# EAGLE design probatio-rotary-8leds-5050 (EAGLE 9.6.2)
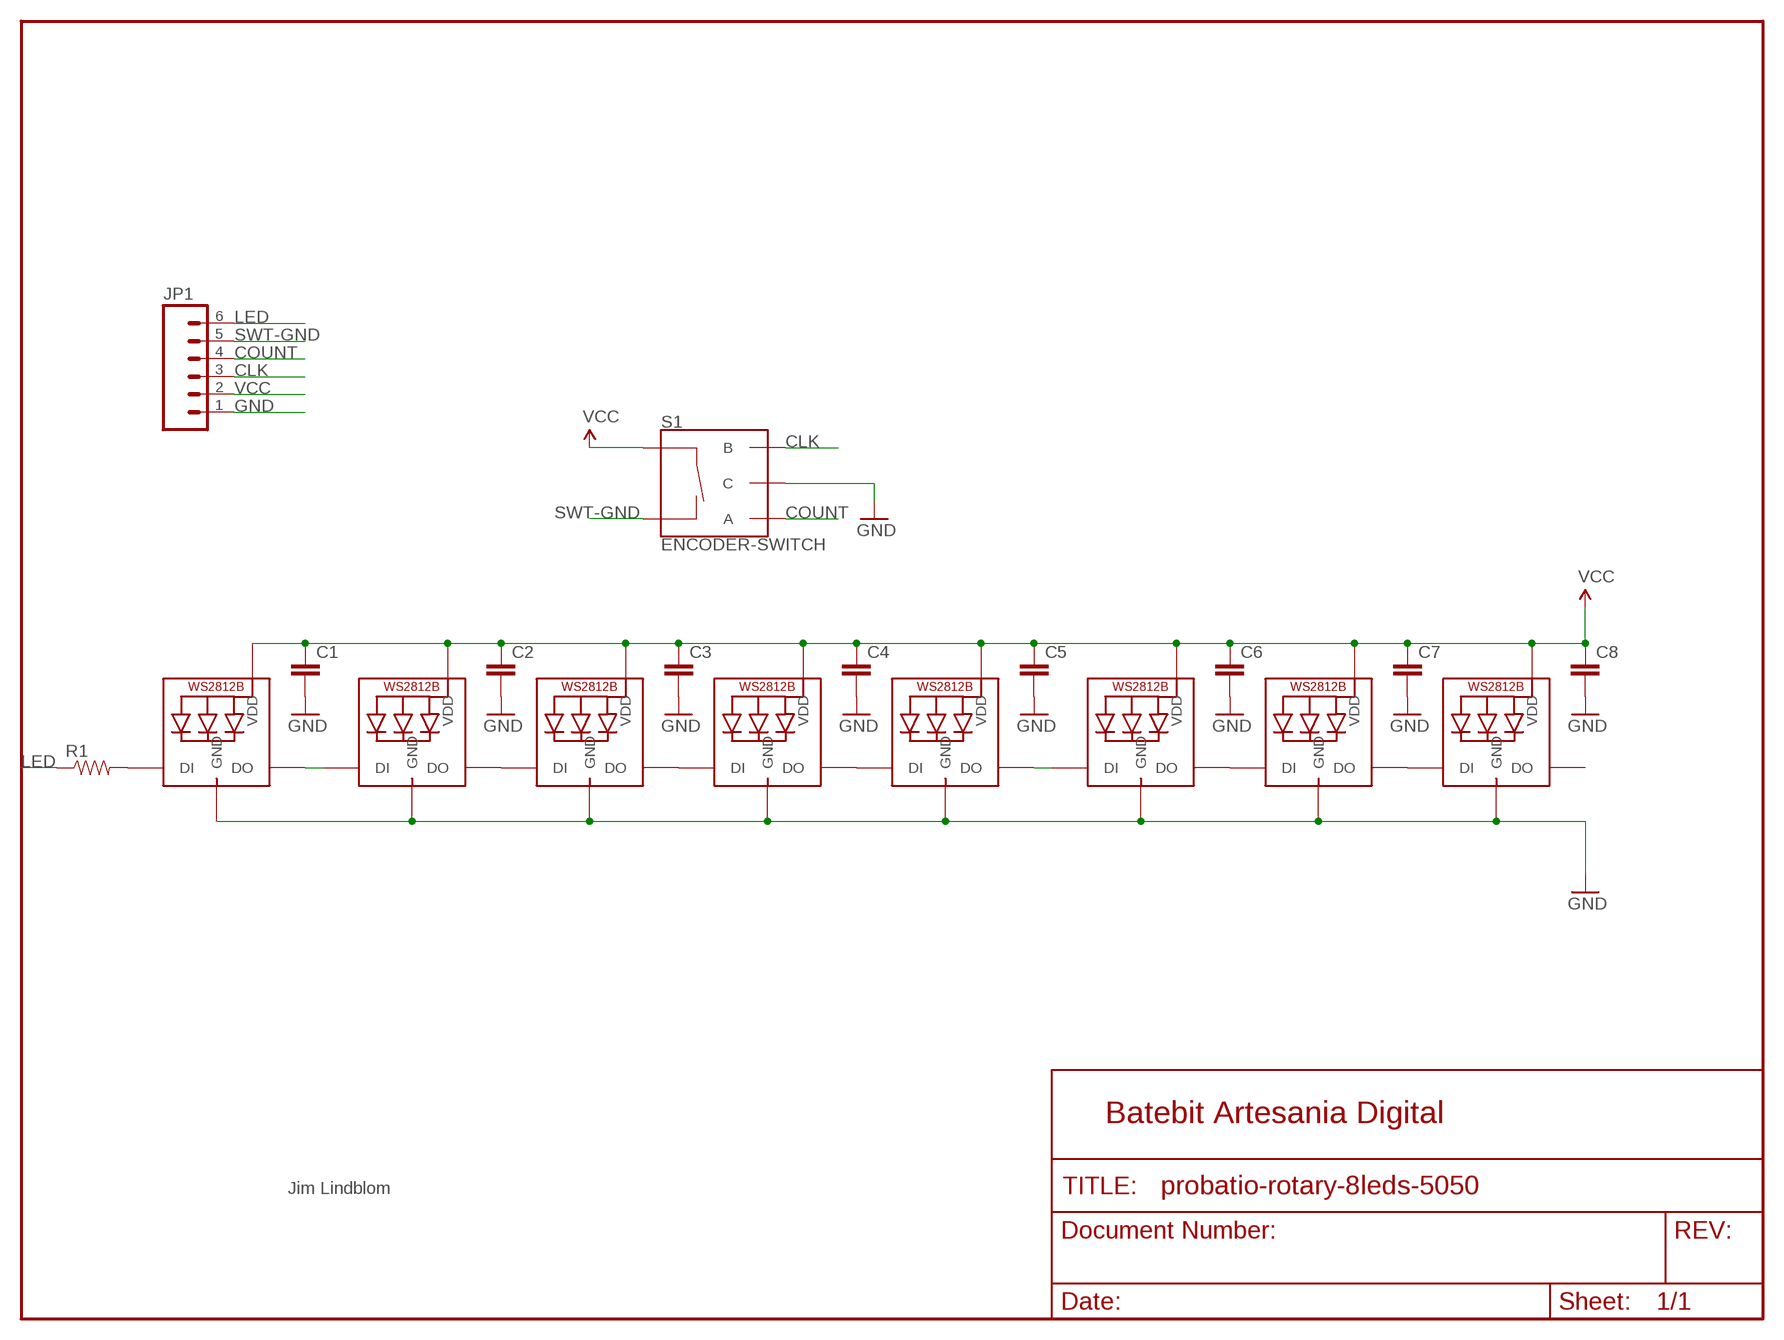
[diagram p0: schematic, sheet 1]

## Parts
C1  CAP0805-CAP  [0805-CAP]
C2  CAP0805-CAP  [0805-CAP]
C3  CAP0805-CAP  [0805-CAP]
C4  CAP0805-CAP  [0805-CAP]
C5  CAP0805-CAP  [0805-CAP]
C6  CAP0805-CAP  [0805-CAP]
C7  CAP0805-CAP  [0805-CAP]
C8  CAP0805-CAP  [0805-CAP]
JP1  M06SILK_FEMALE_PTH  [1X06]
LED1  WS2812B5050  [WS2812B]
LED2  WS2812B5050  [WS2812B]
LED3  WS2812B5050  [WS2812B]
LED4  WS2812B5050  [WS2812B]
LED5  WS2812B5050  [WS2812B]
LED6  WS2812B5050  [WS2812B]
LED7  WS2812B5050  [WS2812B]
LED8  WS2812B5050  [WS2812B]
R1  RESISTOR0805-RES  [0805-RES]
S1  ENCODER-SWITCH  [ROTARY_ENC_PLAIN]

## Nets
CLK: JP1.3 S1.B
COUNT: JP1.4 S1.A
GND [Power]: C1.2 C2.2 C3.2 C4.2 C5.2 C6.2 C7.2 C8.2 JP1.1 LED1.3-GND(GND) LED2.3-GND(GND) LED3.3-GND(GND) LED4.3-GND(GND) LED5.3-GND(GND) LED6.3-GND(GND) LED7.3-GND(GND) LED8.3-GND(GND) S1.C
LED: JP1.6 R1.1
N$1: LED1.2-DOUT(DO) LED2.4-DIN(DI)
N$2: LED1.4-DIN(DI) R1.2
N$3: LED2.2-DOUT(DO) LED3.4-DIN(DI)
N$4: LED5.2-DOUT(DO) LED6.4-DIN(DI)
N$5: LED3.2-DOUT(DO) LED4.4-DIN(DI)
N$6: LED4.2-DOUT(DO) LED5.4-DIN(DI)
N$7: LED6.2-DOUT(DO) LED7.4-DIN(DI)
N$8: LED7.2-DOUT(DO) LED8.4-DIN(DI)
SWT-GND: JP1.5 S1.SW-
VCC [Power]: C1.1 C2.1 C3.1 C4.1 C5.1 C6.1 C7.1 C8.1 JP1.2 LED1.1-VDD(VDD) LED2.1-VDD(VDD) LED3.1-VDD(VDD) LED4.1-VDD(VDD) LED5.1-VDD(VDD) LED6.1-VDD(VDD) LED7.1-VDD(VDD) LED8.1-VDD(VDD) S1.SW+
Unconnected: LED8.2-DOUT(DO)

## Notes on the sheet
- Batebit Artesania Digital
- Jim Lindblom

## Library data of the parts
C1-C8 = Batebit:CAP: Capacitor Standard 0603 ceramic capacitor, and 0.1" leaded capacitor.
JP1 = Batebit:M06: Header 6 Standard 6-pin 0.1" header. Use with straight break away headers (SKU : PRT-00116), right angle break away headers (PRT-00553), swiss pins (PRT-00743), machine pins (PRT-00117), and female headers (PRT-00115). Molex polarized connector foot print use with SKU : PRT-08094 with associated crimp pins and housings. NOTES ON THE VARIANTS LOCK and LOCK_LONGPADS... This footprint was designed to help hold the alignment of a through-hole component (i.e. 6-pin header) while soldering it into place. You may notice that each hole has been shifted either up or down by 0.005 of an inch from it's more standard position (which is a perfectly straight line). This slight alteration caused the pins (the squares in the middle) to touch the edges of the holes. Because they are alternating, it causes a "brace" to hold the component in place. 0.005 has proven to be the perfect amount of "off-center" position when using our standard breakaway headers. Although looks a little odd when you look at the bare footprint, once you have a header in there, the alteration is very hard to notice. Also,if you push a header all the way into place, it is covered up entirely on the bottom side. This idea of altering the position of holes to aid alignment will be further integrated into the Sparkfun Library for other footprints. It can help hold any component with 3 or more connection pins.; PROD_ID: CONN-08437
LED1-LED8 = Batebit:WS2812B
R1 = Batebit:RESISTOR: Resistor Basic schematic elements and footprints for 0603, 1206, and PTH resistors.
S1 = Batebit:ENCODER-SWITCH: Rotary Encoder w/ Select Switch Encoders rotate similarly to potentiometers, but they’re different from potentiometers in that an encoder has full rotation without limits. They output gray code so that you can tell how much and in which direction the encoder has been turned. This encoder includes a push-down select switch built into the shaft. SparkFun Products Rotary Encoder <https://www.sparkfun.com/products/9117> (COM-09117); SF_SKU: COM-09117

## Net classes
0 Default: width 0.305 mm, drill 0.508 mm, clearance 0.305 mm
1 Power: width 0.356 mm, drill 0.508 mm, clearance 0.356 mm
2 LEDPower: width 0.305 mm, drill 0.508 mm, clearance 0.305 mm
3 ButtonSignal: width 0.305 mm, drill 0.508 mm, clearance 0.305 mm

## Board
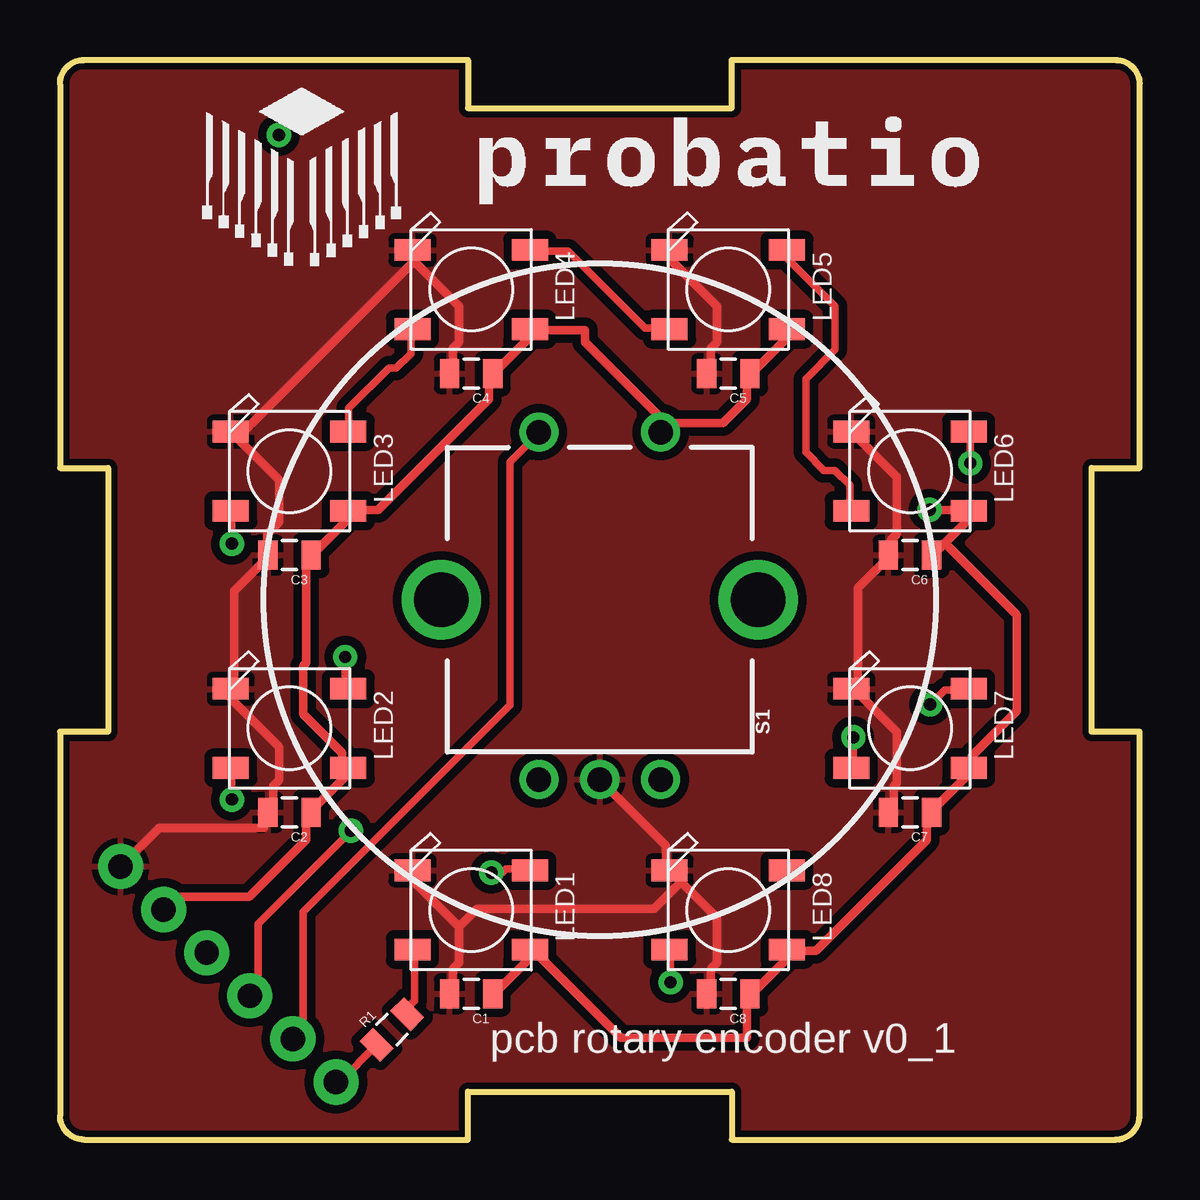
[diagram p1: board, top side]
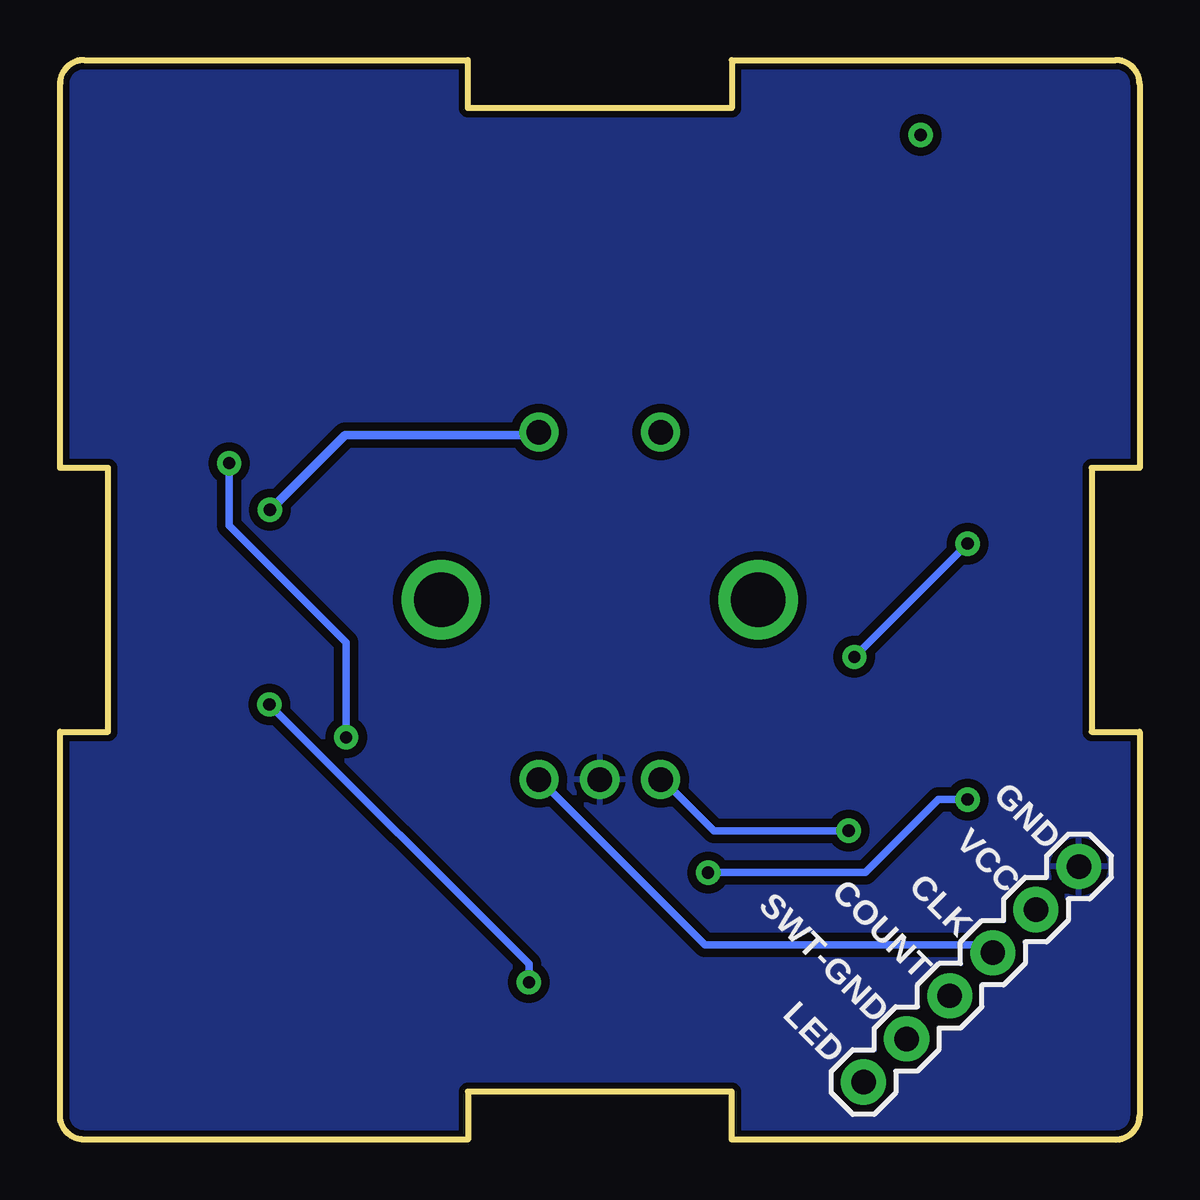
[diagram p2: board, bottom side, seen from below]

Size 45 x 45 mm. Coordinates in mm from the lower left corner, seen from the top.
Outline: 1,0 17,0 17,2 28,2 28,0 44,0 arc90 45,1 45,17 43,17 43,28 45,28 45,44 arc90 44,45 28,45 28,43 17,43 17,45 1,45 arc90 0,44 0,28 2,28 2,17 0,17 0,1 arc90 1,0
Copper layers (1*16): Top 0.035mm / dielectric 1.5mm / Bottom 0.035mm
Design rules "SparkFun": minimum track width 8mil, minimum drill 20mil, track to track 8mil, track to pad 8mil, pad to pad 8mil, via to via 8mil, smd to smd 8mil, copper to edge 10mil, drill to drill 8mil, minimum pad ring 12mil, minimum via ring 10mil, stop-mask expansion 4mil, vias tented up to drill 25mil, thermal gap 10mil

### Footprints (pad centres in the part's own frame; a part is rotated, then mirrored left to right if it is on the bottom)
0805-CAP = smd 0.8 x 1.2: 1 -0.9,0; 2 0.9,0
1X06 = drill 1.016 pad 1.88: 1 0,0; 2 2.54,0; 3 5.08,0; 4 7.62,0; 5 10.16,0; 6 12.7,0
WS2812B = smd 1.5 x 0.9: 1-VDD 2.45,-1.65; 2-DOUT 2.45,1.65; 3-GND -2.45,1.65; 4-DIN -2.45,-1.65
0805-RES = smd 0.8 x 1.2: 1 -0.9,0; 2 0.9,0
ROTARY_ENC_PLAIN = drill 1.016: A 7.493,-2.54; B 7.493,2.54; C 7.493,0; SW+ -6.985,2.54; SW- -6.985,-2.54 | drill 2.286: P$3 0,6.604; P$4 0,-6.604

### Placement (x,y rotation side)
C1  17.14,6.07 180 top
C2  9.57,13.64 180 top
C3  9.57,24.36 180 top
C4  17.14,31.93 180 top
C5  27.86,31.93 180 top
C6  35.43,24.36 180 top
C7  35.43,13.64 180 top
C8  27.86,6.07 180 top
JP1  2.52,11.38 225 bottom
LED1  17.14,9.57 0 top
LED2  9.57,17.14 0 top
LED3  9.57,27.86 0 top
LED4  17.14,35.43 0 top
LED5  27.86,35.43 0 top
LED6  35.43,27.86 0 top
LED7  35.43,17.14 0 top
LED8  27.86,9.57 0 top
R1  13.84,4.59 45 top
S1  22.5,22.5 270 top
U$3  [PROBATIO]  22,40 0 top

### Tracks (layer width: path | path; a pad name or v marks a point on that pad's centre or on a via)
A  (via drill 0.51)
  other vias: 9.12,41.88
CLK
  Bottom 0.305: S1.B 25,15 18.12,8.12 7,8.12 6.75,7.88 6.12,7.88 JP1.3
COUNT  (via drill 0.51)
  Top 0.305: v12.12,12.88 8.25,9 8.25,6.88 8,6.62 8,6 JP1.4
  Bottom 0.305: v12.12,12.88 17.75,12.88 19.88,15 S1.A
GND
  Top 0.356: 33,18.88 34.88,17 34.88,14.88 34.75,14.75 34.75,13.88 34.62,13.75 C7.2 | 33.25,18.88 33.25,23 34.5,24.25 C6.2 34.62,24.5 34.62,25 34.88,25.25 34.88,27.62 33,29.5 | 16.62,8.88 16.62,7.38 16.38,7.12 16.38,6.25 16.25,6.12 C1.2 | 16.62,8.88 14.75,10.75 14.75,11.12 | 25.5,11.12 25.88,10.75 | 25.88,10.75 27.38,9.25 27.38,7.38 27.12,7.12 27.12,6.25 27,6.12 C8.2 | 25.25,11.25 25.25,12.25 S1.C | 16.62,8.88 17.38,9.62 24.75,9.62 25.88,10.75 | 25.5,37 25.5,36.62 27.38,34.75 27.38,33.25 27.12,33 27.12,32.12 27,32 C5.2 | 14.75,36.62 16.62,34.75 16.62,33.25 16.38,33 16.38,32.12 16.25,32 C4.2 | 14.75,37 14.75,36.62 | 7.12,18.75 7.12,18.38 9.12,16.38 9.12,15 8.88,14.75 8.88,13.88 8.75,13.75 C2.2 8.5,13.62 8.5,13 4.12,13 2.62,11.5 JP1.1 | 7.25,18.88 7.25,22.88 8.62,24.25 C3.2 8.62,24.5 8.62,25.25 9.12,25.75 9.12,27.5 LED3.3-GND | 7.5,29.38 14.75,36.62
  pour Top (isolate 0.127): 1,0 0,1 0,17 2,17 2,28 0,28 0,44 1,45 17,45 17,43 28,43 28,45 44,45 45,44 45,28 43,28 43,17 45,17 45,1 44,0 28,0 28,2 17,2 17,0
  pour Bottom (isolate 0.127): 1,0 0,1 0,17 2,17 2,28 0,28 0,44 1,45 17,45 17,43 28,43 28,45 44,45 45,44 45,28 43,28 43,17 45,17 45,1 44,0 28,0 28,2 17,2 17,0
LED
  Top 0.305: R1.1 11.62,2.38 JP1.6
N$1  (via drill 0.51)
  Top 0.305: v7.16,14.17 7.16,15.39 LED2.4-DIN | v17.98,11.12 18.44,11.12 18.59,11.28 19.51,11.28 LED1.2-DOUT
  Bottom 0.305: v7.16,14.17 8.38,14.17 11.43,11.12 v17.98,11.12
N$2
  Top 0.305: R1.2 14.48,5.33 14.48,5.49 14.78,5.79 14.78,7.77 LED1.4-DIN
N$3  (via drill 0.51)
  Top 0.305: v11.89,20.12 11.89,18.9 LED2.2-DOUT | v7.16,24.84 7.16,26.06 LED3.4-DIN
  Bottom 0.305: v7.16,24.84 v11.89,20.12
N$4
  Top 0.305: LED6.4-DIN 32.92,26.21 32.92,27.28 32.31,27.89 31.85,27.89 31.09,28.65 31.09,31.7 32.31,32.92 32.31,34.75 30.33,36.73 30.33,37.03 LED5.2-DOUT
N$5
  Top 0.305: LED3.2-DOUT 12.04,29.57 12.04,30.48 13.72,32.16 14.02,32.16 14.63,32.77 14.63,33.68 LED4.4-DIN
N$6
  Top 0.305: LED4.2-DOUT 19.66,37.03 21.18,37.03 24.38,33.83 25.3,33.83 LED5.4-DIN
N$7  (via drill 0.51)
  Top 0.305: v33.07,16.76 33.07,15.54 LED7.4-DIN | v37.95,28.19 37.95,29.41 LED6.2-DOUT
  Bottom 0.305: v33.07,16.76 33.07,20.73 37.95,25.6 v37.95,28.19
N$8  (via drill 0.51)
  Top 0.305: v25.45,6.55 25.45,7.77 LED8.4-DIN | v36.27,18.14 36.88,18.75 37.8,18.75 LED7.2-DOUT
  Bottom 0.305: v25.45,6.55 25.45,7.32 v36.27,18.14
SWT-GND
  Top 0.305: S1.SW- 19.88,29.38 18.75,28.25 18.75,18.12 10.12,9.5 10.12,5 9.75,4.62 9.75,4.25 JP1.5
VCC  (via drill 0.51)
  Top 0.356: 36.88,24.88 37.88,25.88 37.88,26.12 37.95,26.21 LED6.1-VDD 37.8,26.36 37.75,26.25 v36.25,26.25 | 36.88,24.88 36.38,24.38 C6.1 | C1.1 18.12,6.12 19.5,7.5 19.5,7.88 19.66,7.92 LED1.1-VDD 19.66,7.77 19.76,7.87 | 30.25,7.88 30.25,7.77 | 30.25,7.77 30.25,7.5 28.88,6.12 C8.1 28.62,6 28.62,4.25 23.38,4.25 19.76,7.87 | 19.76,7.87 19.75,7.88 | 30.38,7.88 30.48,7.88 | 30.48,7.88 31.5,7.88 36.12,12.5 36.12,13.38 36.25,13.5 C7.1 36.38,13.75 37.88,15.25 37.88,15.38 37.95,15.54 LED7.1-VDD 37.95,15.7 38,15.7 | 36.88,24.88 39.88,21.88 39.88,17.88 38,16 38,15.7 | 38,15.5 38,15.7 | 19.5,33.75 19.5,33.68 | 19.5,33.68 19.5,33.38 18.12,32 C4.1 17.88,31.88 17.88,30.88 13.25,26.25 12.12,26.25 12.04,26.21 LED3.1-VDD 12.04,26.06 12,26.06 | 12,26.12 12,26.06 | 12,26.06 12,25.88 10.5,24.38 C3.1 10.38,24.25 10.25,24.12 10.25,19.88 10.12,19.75 10.12,17.75 11.75,16.12 11.75,15.25 11.73,15.09 LED2.1-VDD 12.04,15.54 12,15.38 12,15.25 10.5,13.75 C2.1 10.38,13.5 10.25,13.38 10.25,12.5 7.88,10.12 4.38,10.12 4.38,9.62 JP1.2 | 30.25,7.77 30.33,7.77 LED8.1-VDD 30.48,7.92 30.48,7.88 | LED5.1-VDD 30.33,33.83 30.25,33.75 30.25,33.38 28.88,32 C5.1 28.75,31.75 28.62,31.62 28.62,30.88 27.62,29.88 25.12,29.88 S1.SW+ 25,29.5 25,30.12 21.88,33.25 21.88,33.75 19.75,33.75 19.66,33.83 LED4.1-VDD 19.51,33.68 19.5,33.68
  Bottom 0.356: v36.25,26.25 33.12,29.38 25.12,29.38 S1.SW+

### Text on the board
tPlace: pcb rotary encoder v0_1
bPlace: GND | VCC | CLK | COUNT | SWT-GND | LED
Document: J. Tragtenberg | N. Seidle